# EAGLE design OLSD_Arduino_3B (EAGLE 5.10)
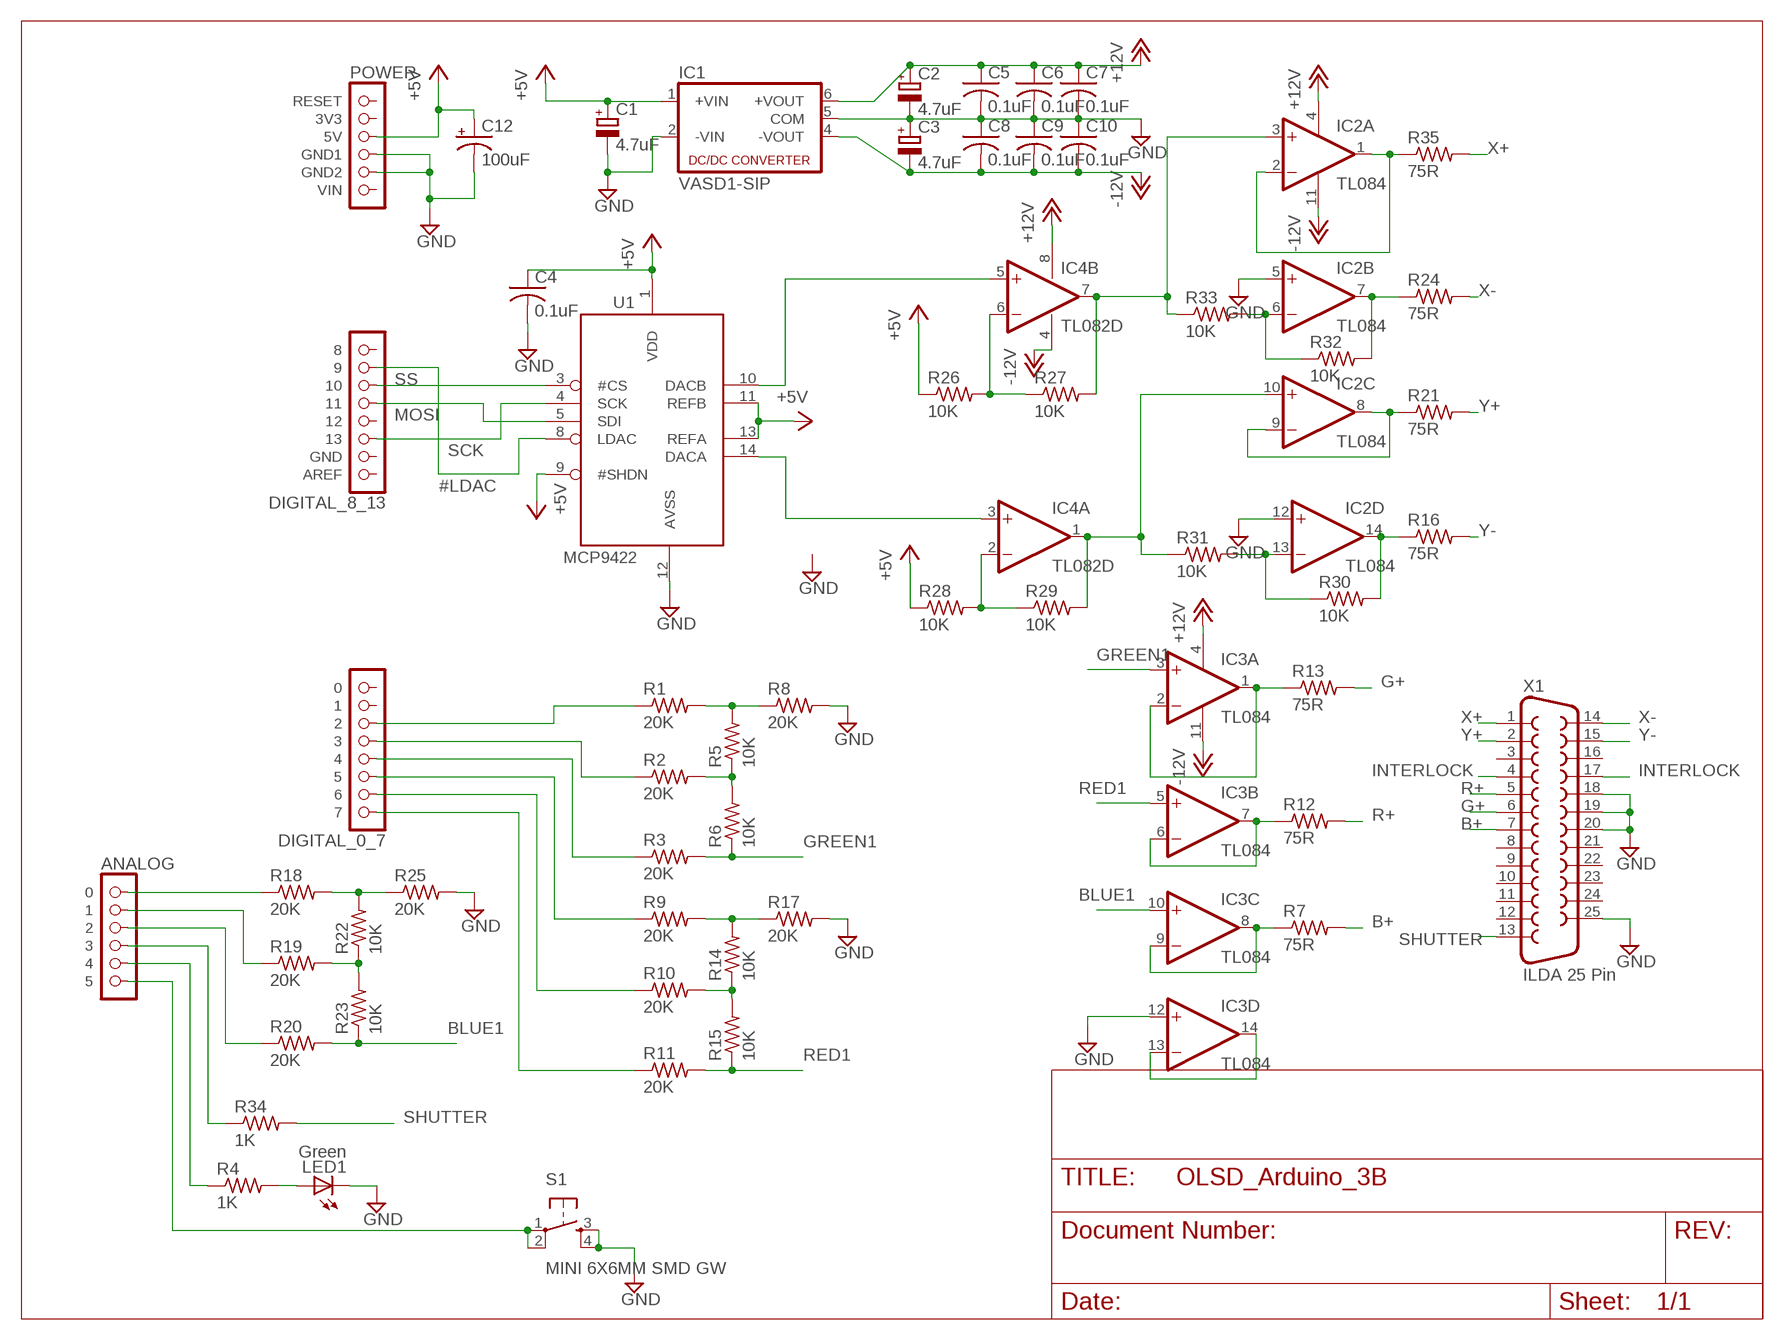
[diagram p0: schematic, sheet 1]

## Parts
C1  4.7uF  CPOL-EUE1.8-4  [E1,8-4]
C2  4.7uF  CPOL-EUE1.8-4  [E1,8-4]
C3  4.7uF  CPOL-EUE1.8-4  [E1,8-4]
C4  0.1uF  C-USC0603  [C0603]
C5  0.1uF  C-USC0603  [C0603]
C6  0.1uF  C-USC0603  [C0603]
C7  0.1uF  C-USC0603  [C0603]
C8  0.1uF  C-USC0603  [C0603]
C9  0.1uF  C-USC0603  [C0603]
C10  0.1uF  C-USC0603  [C0603]
C12  100uF  CAP_POLPTH1  [CPOL-RADIAL-100UF-25V]
IC1  VASD1-SIP  NMA  [NMA]
IC2  TL084  [SOIC-14]
IC3  TL084  [SOIC-14]
IC4  TL082D  [SO08]
LED1  Green  LED  [SMARTLED-TTW]
R1  20K  R-US_R0603  [R0603]
R2  20K  R-US_R0603  [R0603]
R3  20K  R-US_R0603  [R0603]
R4  1K  R-US_R0603  [R0603]
R5  10K  R-US_R0603  [R0603]
R6  10K  R-US_R0603  [R0603]
R7  75R  R-US_R0603  [R0603]
R8  20K  R-US_R0603  [R0603]
R9  20K  R-US_R0603  [R0603]
R10  20K  R-US_R0603  [R0603]
R11  20K  R-US_R0603  [R0603]
R12  75R  R-US_R0603  [R0603]
R13  75R  R-US_R0603  [R0603]
R14  10K  R-US_R0603  [R0603]
R15  10K  R-US_R0603  [R0603]
R16  75R  R-US_R0603  [R0603]
R17  20K  R-US_R0603  [R0603]
R18  20K  R-US_R0603  [R0603]
R19  20K  R-US_R0603  [R0603]
R20  20K  R-US_R0603  [R0603]
R21  75R  R-US_R0603  [R0603]
R22  10K  R-US_R0603  [R0603]
R23  10K  R-US_R0603  [R0603]
R24  75R  R-US_R0603  [R0603]
R25  20K  R-US_R0603  [R0603]
R26  10K  R-US_R0603  [R0603]
R27  10K  R-US_R0603  [R0603]
R28  10K  R-US_R0603  [R0603]
R29  10K  R-US_R0603  [R0603]
R30  10K  R-US_R0603  [R0603]
R31  10K  R-US_R0603  [R0603]
R32  10K  R-US_R0603  [R0603]
R33  10K  R-US_R0603  [R0603]
R34  1K  R-US_R0805  [R0805]
R35  75R  R-US_R0603  [R0603]
S1  MINI 6X6MM SMD GW  TAC_SWITCHSMD  [TACTILE_SWITCH_SMD]
U1  MCP4922  [SOIC-14]
U$1  POWER  [1X06]
U$2  ANALOG  [1X06]
U$3  DIGITAL_0_7  [1X08]
U$4  DIGITAL_8_13  [1X08]
X1  ILDA 25 Pin  F25D  [F25D]

## Nets
#LDAC: U1.8(LDAC) U$4.7
+5V: C1.+ C4.1 C12.1(+) IC1.1(+VIN) R26.1 R28.1 U1.1(VDD) U1.9(#SHDN) U1.11(REFB) U1.13(REFA) U$1.3(5V)
+12V: C2.+ C5.1 C6.1 C7.1 IC1.6(+VOUT) IC2.4(A:V+) IC3.4(A:V+) IC4.8(P:V+)
-12V: C3.- C8.2 C9.2 C10.2 IC1.4(-VOUT) IC2.11(A:V-) IC3.11(A:V-) IC4.4(P:V-)
B1+: IC3.8(C:OUT) IC3.9(C:-IN) R7.1
B+: R7.2 X1.7
BLUE1: IC3.10(C:+IN) R20.2 R23.1
G1+: IC3.1(A:OUT) IC3.2(A:-IN) R13.1
G+: R13.2 X1.6
GND: C1.- C2.- C3.+ C4.2 C5.2 C6.2 C7.2 C8.1 C9.1 C10.1 C12.2(-) IC1.2(-VIN) IC1.5(COM) IC2.5(B:+IN) IC2.12(D:+IN) IC3.12(D:+IN) LED1.C@1(C) R8.2 R17.2 R25.2 S1.3 S1.4 U1.12(AVSS) U$1.4(GND1) U$1.5(GND2) X1.18 X1.19 X1.20 X1.25
GREEN1: IC3.3(A:+IN) R3.2 R6.1
INTERLOCK: X1.4 X1.17
MOSI: U1.5(SDI) U$4.5
N$1: R2.1 U$3.5
N$2: R9.1 U$3.3
N$3: R2.2 R5.1 R6.2
N$4: R1.1 U$3.6
N$5: R1.2 R5.2 R8.1
N$6: R3.1 U$3.4
N$7: R10.1 U$3.2
N$8: R11.1 U$3.1
N$9: R10.2 R14.1 R15.2
N$10: R9.2 R14.2 R17.1
N$11: R18.1 U$2.1
N$12: R19.1 U$2.2
N$13: R4.1 U$2.5
N$14: R19.2 R22.1 R23.2
N$15: R18.2 R22.2 R25.1
N$16: R20.1 U$2.3
N$17: R34.1 U$2.4
N$18: S1.1 S1.2 U$2.6
N$20: LED1.A@1(A) R4.2
N$24: IC4.5(B:+IN) U1.10(DACB)
N$29: IC3.13(D:-IN) IC3.14(D:OUT)
N$30: IC4.6(B:-IN) R26.2 R27.1
N$31: IC4.2(A:-IN) R28.2 R29.1
N$33: IC4.3(A:+IN) U1.14(DACA)
N$35: IC2.6(B:-IN) R32.1 R33.2
N$36: IC2.13(D:-IN) R30.1 R31.2
R1+: IC3.6(B:-IN) IC3.7(B:OUT) R12.1
R+: R12.2 X1.5
RED1: IC3.5(B:+IN) R11.2 R15.1
SCK: U1.4(SCK) U$4.3
SHUTTER: R34.2 X1.13
SS: U1.3(#CS) U$4.6
X1+: IC2.1(A:OUT) IC2.2(A:-IN) R35.1
X1-: IC2.7(B:OUT) R24.1 R32.2
X2: IC2.10(C:+IN) IC4.1(A:OUT) R29.2 R31.1
X+: R35.2 X1.1
X-: R24.2 X1.14
Y1+: IC2.8(C:OUT) IC2.9(C:-IN) R21.1
Y1-: IC2.14(D:OUT) R16.1 R30.2
Y2: IC2.3(A:+IN) IC4.7(B:OUT) R27.2 R33.1
Y+: R21.2 X1.2
Y-: R16.2 X1.15
Unconnected: U$1.1(RESET) U$1.2(3V3) U$1.6(VIN) U$3.7 U$3.8 U$4.1(AREF) U$4.2(GND) U$4.4 U$4.8 X1.3 X1.8 X1.9 X1.10 X1.11 X1.12 X1.16 X1.21 X1.22 X1.23 X1.24

## Library data of the parts
C1-C3 = rcl:CPOL-EU: POLARIZED CAPACITOR, European symbol
C4-C10 = adafruit:C-US: CAPACITOR, American symbol
C12 = SparkFun:CAP_POL: Capacitor Polarized These are standard SMD and PTH capacitors. Normally 10uF, 47uF, and 100uF in electrolytic and tantalum varieties. Always verify the external diameter of the through hole cap, it varies with capacity, voltage, and manufacturer. The EIA devices should be standard.
IC1 = dc-dc-converter:NMA: DC-DC CONVERTER
IC2 IC3 = favreau:TL084: Texas Instruments TL084 JFET General Purpose Op-Amp
IC4 = linear:TL082: OP AMP
LED1 = led:LED: LED OSRAM: - CHIPLED LG R971, LG N971, LY N971, LG Q971, LY Q971, LO R971, LY R971 LH N974, LH R974 LS Q976, LO Q976, LY Q976 LO Q996 - Hyper CHIPLED LW Q18S LB Q993, LB Q99A, LB R99A - SideLED LS A670, LO A670, LY A670, LG A670, LP A670 LB A673, LV A673, LT A673, LW A673 LH A674 LY A675 LS A676, LA A676, LO A676, LY A676, LW A676 LS A679, LY A679, LG A679 - Hyper Micro SIDELED® LS Y876, LA Y876, LO Y876, LY Y876 LT Y87S - SmartLED LW L88C, LW L88S LB L89C, LB L89S, LG L890 LS L89K, LO L89K, LY L89K LS L896, LA L896, LO L896, LY L896 - TOPLED LS T670, LO T670, LY T670, LG T670, LP T670 LSG T670, LSP T670, LSY T670, LOP T670, LYG T670 LG T671, LOG T671, LSG T671 LB T673, LV T673, LT T673, LW T673 LH T674 LS T676, LA T676, LO T676, LY T676, LB T676, LH T676, LSB T676, LW T676 LB T67C, LV T67C, LT T67C, LS T67K, LO T67K, LY T67K, LW E67C LS E67B, LA E67B, LO E67B, LY E67B, LB E67C, LV E67C, LT E67C LW T67C LS T679, LY T679, LG T679 LS T770, LO T770, LY T770, LG T770, LP T770 LB T773, LV T773, LT T773, LW T773 LH T774 LS E675, LA E675, LY E675, LS T675 LS T776, LA T776, LO T776, LY T776, LB T776 LHGB T686 LT T68C, LB T68C - Hyper Mini TOPLED® LB M676 - Mini TOPLED Santana® LG M470 LS M47K, LO M47K, LY M47K Source: http://www.osram.convergy.de LUXEON: - LUMILED® LXK2-PW12-R00, LXK2-PW12-S00, LXK2-PW14-U00, LXK2-PW14-V00 LXK2-PM12-R00, LXK2-PM12-S00, LXK2-PM14-U00 LXK2-PE12-Q00, LXK2-PE12-R00, LXK2-PE12-S00, LXK2-PE14-T00, LXK2-PE14-U00 LXK2-PB12-K00, LXK2-PB12-L00, LXK2-PB12-M00, LXK2-PB14-N00, LXK2-PB14-P00, LXK2-PB14-Q00 LXK2-PR12-L00, LXK2-PR12-M00, LXK2-PR14-Q00, LXK2-PR14-R00 LXK2-PD12-Q00, LXK2-PD12-R00, LXK2-PD12-S00 LXK2-PH12-R00, LXK2-PH12-S00 LXK2-PL12-P00, LXK2-PL12-Q00, LXK2-PL12-R00 Source: www.luxeon.com KINGBRIGHT: KA-3528ASYC Source: www.kingbright.com
R1-R35 = resistor:R-US_: RESISTOR, American symbol
S1 = SparkFun:TAC_SWITCH: Momentary Switch Button commonly used for reset or general input. Spark Fun Electronics SKU : COM-00097
U1 = favreau:MCP4922
U$1 = arduino:POWER
U$2 = arduino:ANALOG
U$3 = arduino:DIGITAL_0_7
U$4 = arduino:DIGITAL_8_13
X1 = SparkFun:F25: D-SUB 25 25 Pin male connector. PCB edge mount for regular PCB thicknesses. This connector will connect directly to the back of a PC parallel port or through a normal DB25 extension cable (M/F). SKU: PRT-08287

## Board
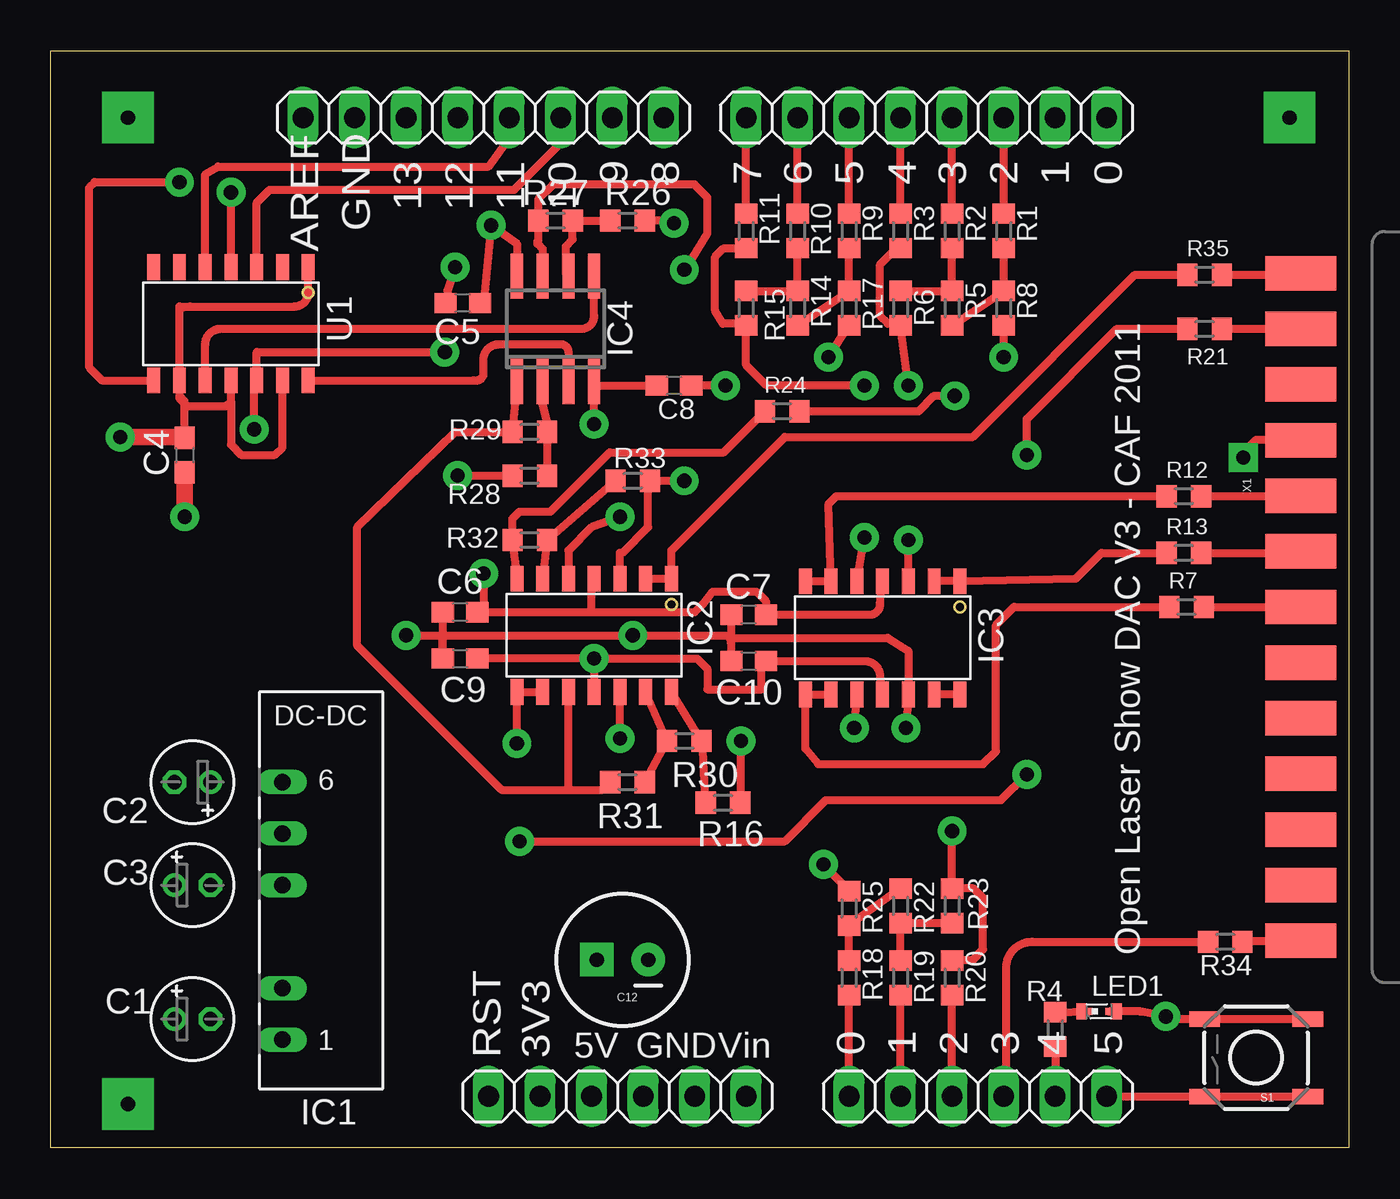
[diagram p1: board, top side]
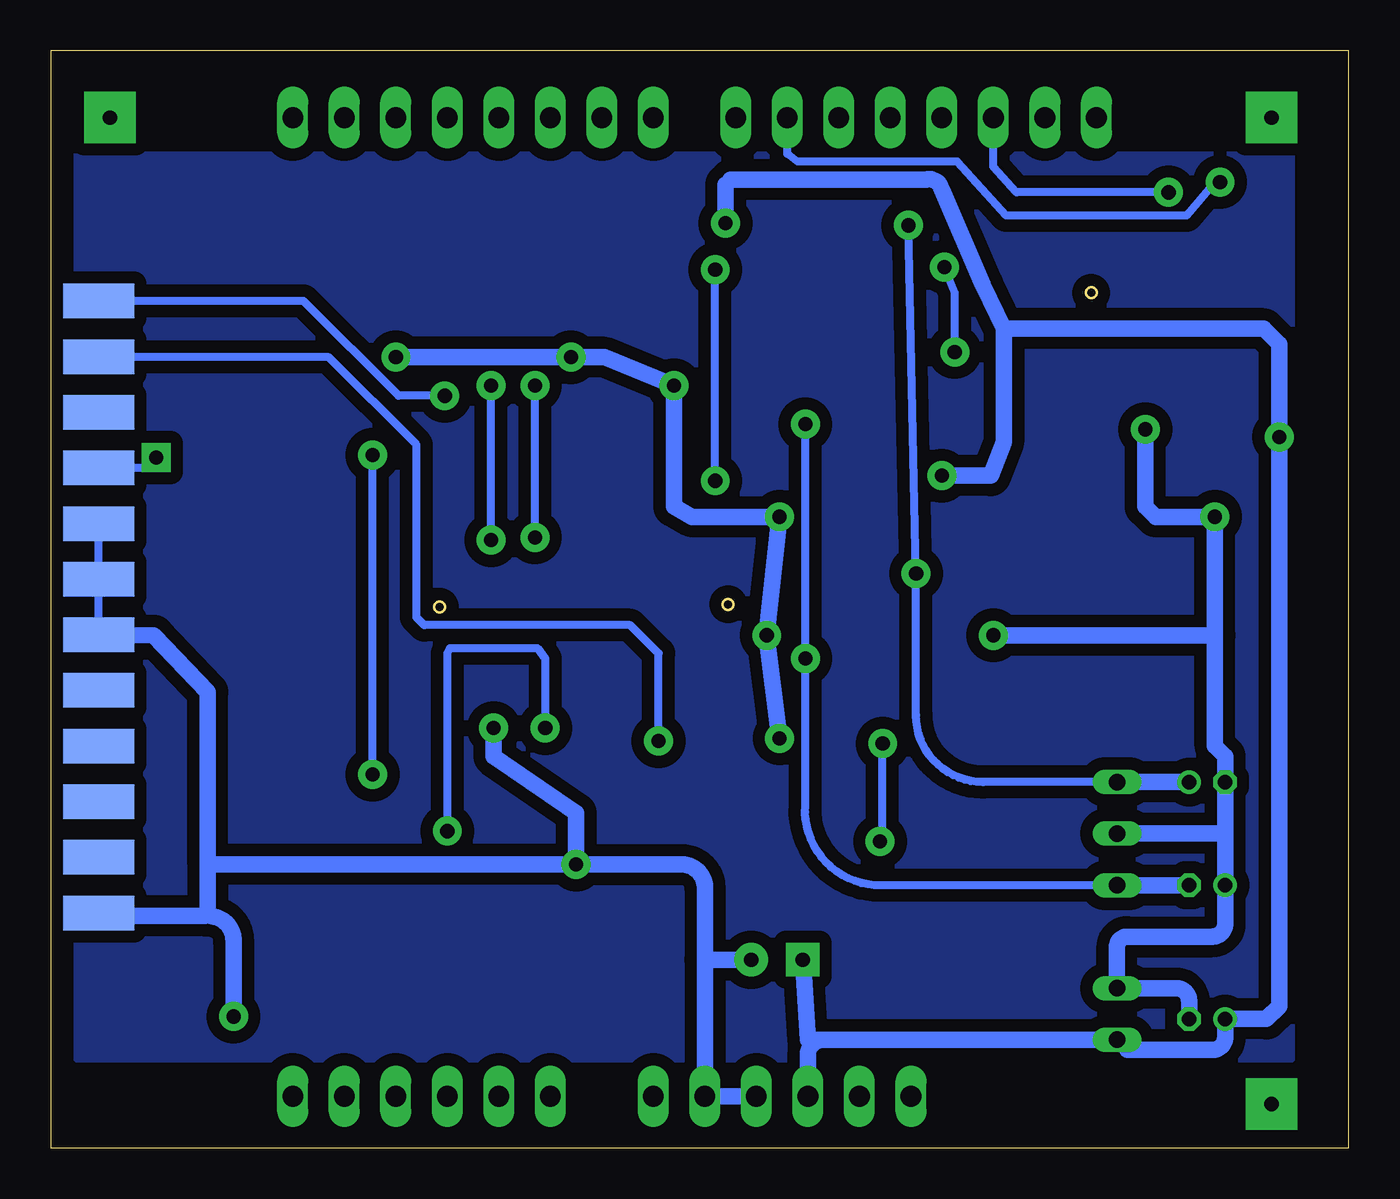
[diagram p2: board, bottom side, seen from below]

Size 64.01 x 54.1 mm. Coordinates in mm from the lower left corner, seen from the top.
Outline: 0,54.1 64.01,54.1 64.01,0 0,0 0,54.1
Copper layers (1*16): Top 0.0356mm / dielectric 1.5011mm / Bottom 0.0356mm
Design rules "LaenPCBOrder": minimum track width 6mil, minimum drill 13mil, track to track 6mil, track to pad 6mil, pad to pad 6mil, via to via 6mil, smd to smd 6mil, copper to edge 15mil, drill to drill 6mil, minimum pad ring 7mil, minimum via ring 7mil, stop-mask expansion 4mil, vias tented up to drill 0mil, thermal gap 10mil

### Footprints (pad centres in the part's own frame; a part is rotated, then mirrored left to right if it is on the bottom)
E1,8-4 = drill 0.711 pad 1.168 round: + -0.889,0 | drill 0.711 pad 1.168 octagon: - 0.889,0
C0603 = smd 1.1 x 1: 1 -0.85,0; 2 0.85,0
CPOL-RADIAL-100UF-25V = drill 0.7 pad 1.651 square: 1 1.27,0 | drill 0.7 pad 1.651 round: 2 -1.27,0
NMA = drill 0.813 long: 1 0,6.35; 2 0,3.81; 4 0,-1.27; 5 0,-3.81; 6 0,-6.35
SOIC-14 = smd 1.27 x 0.635: 1 -0.762,-0.508; 2 -0.762,-1.778; 3 -0.762,-3.048; 4 -0.762,-4.318; 5 -0.762,-5.588; 6 -0.762,-6.858; 7 -0.762,-8.128; 8 4.826,-8.128; 9 4.826,-6.858; 10 4.826,-5.588; 11 4.826,-4.318; 12 4.826,-3.048; 13 4.826,-1.778; 14 4.826,-0.508
SO08 = smd 0.6 x 2.2: 1 -1.905,-2.6; 2 -0.635,-2.6; 3 0.635,-2.6; 4 1.905,-2.6; 5 1.905,2.6; 6 0.635,2.6; 7 -0.635,2.6; 8 -1.905,2.6
SMARTLED-TTW = smd 0.8 x 0.5: A 0,-0.875; C 0,0.875 | smd 0.35 x 0.35: A@1 0,-0.5; C@1 0,0.5
R0603 = smd 1 x 1.1: 1 -0.85,0; 2 0.85,0
TACTILE_SWITCH_SMD = smd 1.524 x 0.762: 1 -2.54,1.905; 2 2.54,1.905; 3 -2.54,-1.905; 4 2.54,-1.905
1X06 = drill 1.016 long: 1 -6.35,0; 2 -3.81,0; 3 -1.27,0; 4 1.27,0; 5 3.81,0; 6 6.35,0
1X08 = drill 1.016 long: 1 -8.89,0; 2 -6.35,0; 3 -3.81,0; 4 -1.27,0; 5 1.27,0; 6 3.81,0; 7 6.35,0; 8 8.89,0
F25D = smd 1.7 x 3.5: 1 -16.459,-6.045; 2 -13.716,-6.045; 3 -10.973,-6.045; 4 -8.23,-6.045; 5 -5.486,-6.045; 6 -2.743,-6.045; 7 0,-6.045; 8 2.743,-6.045; 9 5.486,-6.045; 10 8.23,-6.045; 11 10.973,-6.045; 12 13.716,-6.045; 13 16.459,-6.045 | smd 1.7 x 3.5 bottom: 14 -15.088,-6.045; 15 -12.344,-6.045; 16 -9.601,-6.045; 17 -6.858,-6.045; 18 -4.115,-6.045; 19 -1.372,-6.045; 20 1.372,-6.045; 21 4.115,-6.045; 22 6.858,-6.045; 23 9.601,-6.045; 24 12.344,-6.045; 25 15.088,-6.045

### Placement (x,y rotation side)
C1  6.99,6.35 0 top
C2  6.99,18.03 180 top
C3  6.99,12.95 0 top
C4  6.6,34.16 270 top
C5  20.32,41.66 180 top
C6  20.19,26.42 180 top
C7  34.42,26.29 180 top
C8  30.73,37.59 180 top
C9  20.19,24.13 0 top
C10  34.42,24 0 top
C12  28.19,9.27 180 top
IC1  11.43,11.68 180 top
IC2  31.12,27.3 270 top
IC3  45.34,27.18 270 top
IC4  24.89,40.39 0 top
LED1  51.69,6.73 270 top
R1  46.99,45.21 270 top
R2  44.45,45.21 270 top
R3  41.91,45.21 270 top
R4  49.53,5.84 90 top
R5  44.45,41.4 270 top
R6  41.91,41.4 90 top
R7  56.01,26.67 0 top
R8  46.99,41.4 270 top
R9  39.37,45.21 270 top
R10  36.83,45.21 270 top
R11  34.29,45.21 270 top
R12  55.88,32.13 0 top
R13  55.88,29.34 0 top
R14  36.83,41.4 270 top
R15  34.29,41.4 90 top
R16  33.15,17.02 0 top
R17  39.37,41.4 270 top
R18  39.37,8.38 90 top
R19  41.91,8.38 90 top
R20  44.45,8.38 90 top
R21  56.9,40.39 0 top
R22  41.91,11.94 90 top
R23  44.45,11.94 270 top
R24  36.07,36.32 0 top
R25  39.37,11.81 90 top
R26  28.45,45.72 180 top
R27  24.89,45.72 180 top
R28  23.62,33.15 0 top
R29  23.62,35.31 180 top
R30  31.24,20.07 0 top
R31  28.45,18.03 0 top
R32  23.62,29.97 180 top
R33  28.7,32.89 180 top
R34  1K  [R0603]  57.91,10.16 0 top
R35  56.9,43.05 0 top
S1  59.44,4.45 180 top
U1  13.21,42.67 270 top
U$1  27.94,2.54 0 top
U$2  45.72,2.54 0 top
U$3  43.18,50.8 0 top
U$4  21.34,50.8 0 top
X1  67.69,26.67 270 top

### Tracks (layer width: path | path; a pad name or v marks a point on that pad's centre or on a via)
#LDAC  (via drill 0.7 pad 1.42)
  Top 0.406: U1.8 2.54,37.85 1.91,38.48 1.91,47.37 2.16,47.62 v6.35,47.62
  Bottom 0.406: v6.35,47.62 6.6,47.62 8,45.97 16.89,45.97 19.3,48.64 27.18,48.64 27.69,49.02 U$4.7
+5V  (via drill 0.7 pad 1.42)
  Top 0.406: 8.89,36.83 8.64,36.58 6.73,36.58 6.35,36.96 6.35,37.08 | 6.86,41.49 6.35,41.49 U1.9 | 6.86,41.49 12.03,41.49 arc90 12.7,42.16 U1.1 | v20.07,33.15 R28.1 | R26.1 30.73,45.72 v30.73,45.59 | U1.9 6.35,37.72 | 6.35,37.08 U1.9 | 8.89,36.83 U1.11 | 8.89,36.83 8.89,34.67 9.4,34.16 11.05,34.16 11.43,34.54 U1.13 | 6.86,41.49 6.44,41.4 | C4.1 6.6,36.83 6.35,37.08
  Top 0.813: v3.43,35.05 6.57,35.05 C4.1
  Bottom 0.406: 10.92,4.83 arc90 IC1.1 | 30.48,47.75 30.73,47.5
  Bottom 0.813: 10.92,4.83 6.73,4.83 arc-90 6.1,5.46 C1.+ 4.06,6.35 3.43,6.99 v3.43,35.05 3.43,39.62 4.19,40.39 17.02,40.39 | U$1.3 26.67,4.57 arc90 25.91,5.33 | 17.02,40.39 18.03,42.55 20.07,47.24 arc-90 20.83,47.75 30.48,47.75 | v20.07,33.15 17.65,33.15 17.02,34.8 17.02,40.39 | 30.73,47.5 v30.73,45.59 | IC1.1 25.91,5.33 | C12.1 26.67,5.33 25.91,5.33
+12V  (via drill 0.7 pad 1.42)
  Top 0.406: C5.1 21.34,41.66 v21.72,45.49 22.99,44.58 IC4.8 | IC3.4 40.89,26.8 arc-90 40.39,26.29 35.39,26.29 arc90 C7.1 35.27,26.96 34.8,27.43 32.64,27.43 32.13,26.8 31.75,26.42 26.67,26.42 | 21.46,26.42 C6.1 | 21.46,26.42 26.67,26.42 | 26.67,26.42 26.67,27.94 IC2.4 | 21.46,26.42 21.34,26.54 v21.34,28.32
  Bottom 0.406: v21.72,45.49 v21.34,28.32 21.34,21.34 arc-90 18.03,18.03 IC1.6
  Bottom 0.813: C2.+ IC1.6
-12V  (via drill 0.7 pad 1.42)
  Top 0.406: 26.99,37.59 arc-90 IC4.4 | 26.99,37.59 C8.2 | C10.2 40.13,24 arc-90 40.89,23.24 IC3.11 | C10.2 35.31,24 35.43,23.88 | v26.8,24.13 C9.2 | v26.8,24.13 31.88,24.13 32.38,23.62 32.38,22.61 35.05,22.61 35.05,23.79 C10.2 | v26.8,24.13 IC2.11 | 26.99,37.59 26.8,37.59 v26.8,35.69
  Bottom 0.406: IC1.4 23.37,12.95 arc90 26.8,16.89 v26.8,24.13 v26.8,35.69
  Bottom 0.813: C3.- IC1.4
B1+
  Top 0.406: IC3.9 IC3.8 37.21,19.68 37.85,18.92 45.97,18.92 46.61,19.56 46.61,25.78 47.5,26.67 R7.1
B+
  Top 0.406: R7.2 X1.7
BLUE1  (via drill 0.7 pad 1.42)
  Top 0.406: R20.2 44.49,9.27 45.47,9.27 45.97,9.78 45.97,12.32 45.5,12.79 R23.1 v44.45,15.62 | v39.62,20.7 IC3.10
  Bottom 0.406: v39.62,20.7 39.62,24.13 40,24.64 44.32,24.64 44.45,24.38 v44.45,15.62
G1+
  Top 0.406: IC3.2 IC3.1 50.55,28.07 51.82,29.34 R13.1
G+
  Top 0.406: 62.71,29.34 X1.6 61.57,29.34 R13.2
GND  (via drill 0.7 pad 1.42)
  Top 0.406: v38.1,13.97 R25.2 | 19.56,41.66 C5.2 19.56,41.74 19.56,42.29 v19.94,43.43 | v33.27,37.59 C8.1 | v38.35,38.99 R17.2 | C7.2 C10.1 33.54,24.91 | 33.54,24.91 33.53,25.15 41.27,25.15 42.29,24.51 IC3.12 v42.16,20.7 | C9.1 C6.2 | 19.3,25.27 C9.1 | 19.3,25.27 v28.7,25.27 33.54,25.27 33.54,24.91 | C9.1 19.3,24.13 19.3,25.27 | v17.53,25.27 19.3,25.27 | IC2.5 25.53,29.46 26.67,30.61 v28.07,31.11 | v28.07,20.19 IC2.12 | S1.3 S1.4 55.12,6.35 v54.99,6.48 53.72,6.73 LED1.C@1 | v46.99,38.99 R8.2 | v10.03,35.43 10.03,37.72 U1.12 10.16,39.24 v19.43,39.24
  Top 0.813: v6.6,31.11 C4.2
  Bottom 0.406: 62.64,11.43 arc90 X1.25 | 56.13,11.43 56.39,11.43 56.26,11.56 | X1.18 X1.19 X1.20 | v46.99,38.99 47.12,38.99 | v19.43,39.24 19.43,42.16 v19.94,43.43
  Bottom 0.813: C1.- 7.87,7.24 arc-90 8.51,7.87 IC1.2 11.43,9.91 arc90 10.92,10.41 6.73,10.41 arc-90 6.1,11.05 C3.+ 6.1,15.49 | 6.1,15.49 C2.- 6.1,19.3 6.6,19.81 6.6,25.27 | v38.1,13.97 32.89,13.97 arc90 31.75,12.83 31.75,9.27 | v38.1,13.97 56.26,13.97 | 56.39,11.43 62.64,11.43 | 56.13,11.43 arc90 54.99,10.16 v54.99,6.48 | v38.1,13.97 38.1,16.51 42.16,19.3 v42.16,20.7 | X1.20 58.93,25.27 56.26,22.48 56.26,13.97 | 56.26,13.97 56.26,11.56 | v46.99,38.99 v38.35,38.99 36.7,38.99 v33.27,37.59 33.27,31.62 32.38,31.11 v28.07,31.11 v28.7,25.27 v28.07,20.19 | 6.1,15.49 IC1.5 | U$1.4 U$1.5 31.75,9.27 | 31.75,9.27 C12.2 | 6.6,25.27 v17.53,25.27 | 6.6,25.27 v6.6,31.11 9.52,31.11 10.03,31.62 v10.03,35.43
GREEN1  (via drill 0.7 pad 1.42)
  Top 0.406: R3.2 41.7,44.36 40.89,43.56 40.89,41.02 41.27,40.64 42.2,40.64 R6.1 v42.29,37.59 | IC3.3 v42.29,29.97
  Bottom 0.406: v42.29,29.97 v42.29,37.59
INTERLOCK  (via drill 0.7 pad 1.42)
  Top 0.406: 62.86,34.92 X1.4 62.76,34.92 59.44,34.92 59.05,34.54 v58.8,34.04
  Bottom 0.406: X1.17 59.18,33.53 v58.8,34.04
MOSI
  Top 0.406: U1.5 7.62,48.01 8.25,48.39 21.59,48.39 22.61,49.78 U$4.5
N$1
  Top 0.406: R2.1 U$3.5
N$2
  Top 0.406: R9.1 U$3.3
N$3
  Top 0.406: R2.2 R5.1 R6.2
N$4
  Top 0.406: R1.1 U$3.6
N$5
  Top 0.406: R1.2 R8.1 R5.2
N$6
  Top 0.406: R3.1 U$3.4
N$7
  Top 0.406: R10.1 U$3.2
N$8
  Top 0.406: R11.1 U$3.1
N$9
  Top 0.406: R10.2 R14.1 R15.2
N$10
  Top 0.406: R9.2 R17.1 R14.2
N$11
  Top 0.406: U$2.1 R18.1
N$12
  Top 0.406: U$2.2 R19.1
N$13
  Top 0.406: R4.1 U$2.5
N$14
  Top 0.406: R23.2 R22.1 R19.2
N$15
  Top 0.406: R18.2 R25.1 R22.2
N$16
  Top 0.406: U$2.3 R20.1
N$17
  Top 0.406: U$2.4 arc90 47.12,2.67 47.12,8.89 arc-90 48.39,10.16 R34.1
N$18
  Top 0.406: U$2.6 S1.2 S1.1
N$19  (via drill 0.7 pad 2.54)
  other vias: 3.81,50.8
N$20
  Top 0.406: R4.2 LED1.A@1
N$21  (via drill 0.7 pad 2.54)
  other vias: 61.09,50.8
N$22  (via drill 0.7 pad 2.54)
  other vias: 3.81,2.16
N$23
  pour Bottom (isolate 0.61): 2.79,49.02 2.79,4.32 62.74,4.32 62.74,49.02
N$24
  Top 0.406: IC4.5 26.8,41.02 arc-90 26.16,40.39 8.38,40.39 arc90 7.62,39.62 U1.10
N$29
  Top 0.406: 43.43,22.35 IC3.13 IC3.14
N$30
  Top 0.406: IC4.6 25.4,43.11 25.4,44.45 25.74,44.79 R27.1 R26.2
N$31
  Top 0.406: IC4.2 24.26,36.7 24.64,35.14 R29.1 R28.2
N$33
  Top 0.406: IC4.3 25.53,39.24 arc90 25.15,39.62 22.1,39.62 arc90 21.34,38.86 21.34,38.1 arc-90 20.83,37.85 U1.14
N$35
  Top 0.406: IC2.6 R32.1 R33.2
N$36
  Top 0.406: IC2.13 R30.1 R31.2
R1+
  Top 0.406: IC3.7 IC3.6 38.35,31.75 38.73,32.13 R12.1
R+
  Top 0.406: 62.76,32.13 X1.5 61.62,32.13 R12.2
RED1  (via drill 0.7 pad 1.42)
  Top 0.406: R11.2 33.19,44.36 32.77,43.94 32.77,41.27 33.15,40.64 34.2,40.64 R15.1 34.29,38.61 35.31,37.59 v40.13,37.59 | IC3.5 v40.13,30.1
  Bottom 0.406: v40.13,30.1 v40.13,37.59
SCK  (via drill 0.7 pad 1.42)
  Top 0.406: U1.4 v8.89,47.12
  Bottom 0.406: v8.89,47.12 16.38,47.12 17.53,48.39 U$4.3
SHUTTER
  Top 0.406: R34.2 arc-90 58.81,10.21 X1.13
SS
  Top 0.406: U1.3 10.16,46.61 10.79,47.24 22.86,47.24 25.15,49.53 U$4.6
X1+
  Top 0.406: IC2.2 IC2.1 30.61,29.46 36.2,35.05 45.47,35.05 53.47,43.05 R35.1
X1-
  Top 0.406: IC2.7 arc90 23.03,28.11 R32.2 22.77,31.03 23.11,31.37 24.64,31.37 27.56,34.29 33.19,34.29 R24.1
X2
  Top 0.406: IC4.1 arc-90 23.03,37.75 R29.2 19.94,35.31 15.11,30.61 15.11,24.77 22.23,17.65 25.53,17.65 | 25.53,17.65 27.22,17.65 R31.1 | 25.53,17.65 IC2.10
X+
  Top 0.406: 62.71,43.05 X1.1 61.57,43.05 R35.2
X-  (via drill 0.7 pad 1.42)
  Top 0.406: v44.58,37.08 43.56,37.08 42.8,36.32 R24.2
  Bottom 0.406: X1.14 51.54,41.76 46.86,37.08 v44.58,37.08
Y1+  (via drill 0.7 pad 1.42)
  Top 0.406: IC2.9 IC2.8 v22.99,19.94 | v23.11,15.11 36.2,15.11 38.23,17.14 46.86,17.14 v48.13,18.41 | v48.13,34.16 48.13,35.94 52.58,40.39 R21.1
  Bottom 0.406: v22.99,19.94 22.99,15.24 v23.11,15.11 | v48.13,18.41 v48.13,34.16
Y1-
  Top 0.406: IC2.14 R30.2 32.17,19.61 R16.1
Y2  (via drill 0.7 pad 1.42)
  Top 0.406: IC2.3 28.07,29.34 28.19,29.34 29.46,30.61 29.46,32.85 R33.1 v31.24,32.89 | v31.24,43.31 31.37,43.43 32.38,45.09 32.38,46.86 31.75,47.5 24.77,47.5 24.04,46.77 R27.2 24.04,44.74 24,44.7 24,44.58 24.26,44.32 IC4.7
  Bottom 0.406: v31.24,32.89 v31.24,43.31
Y+
  Top 0.406: R21.2 X1.2
Y-  (via drill 0.7 pad 1.42)
  Top 0.406: v34.04,20.07 34.04,16.98 R16.2
  Bottom 0.406: v34.04,20.07 34.04,24.38 35.43,25.78 45.59,25.78 45.97,26.16 45.97,34.67 50.29,38.99 62.76,38.99 X1.15

### Text on the board
tNames: 9 | 8 | 7 | 6 | 5 | 4 | 3 | 2 | 1 | 0 | 13 | 12 | 11 | 10 | GND | AREF | Open Laser Show DAC V3 - CAF 2011 | 0 | 1 | 2 | 3 | 4 | 5 | RST | 3V3 | 5V | GND | Vin
TallParts: USB | ISP | PWR
ArduinoHoles: 3.2mm | 2.2mm | 3.2mm